# Altium schematic sheet Project_Overview.SchDoc
size A4; BoardName: ECG Pocket Monitor; SheetNumber: 1; SheetTotal: 8
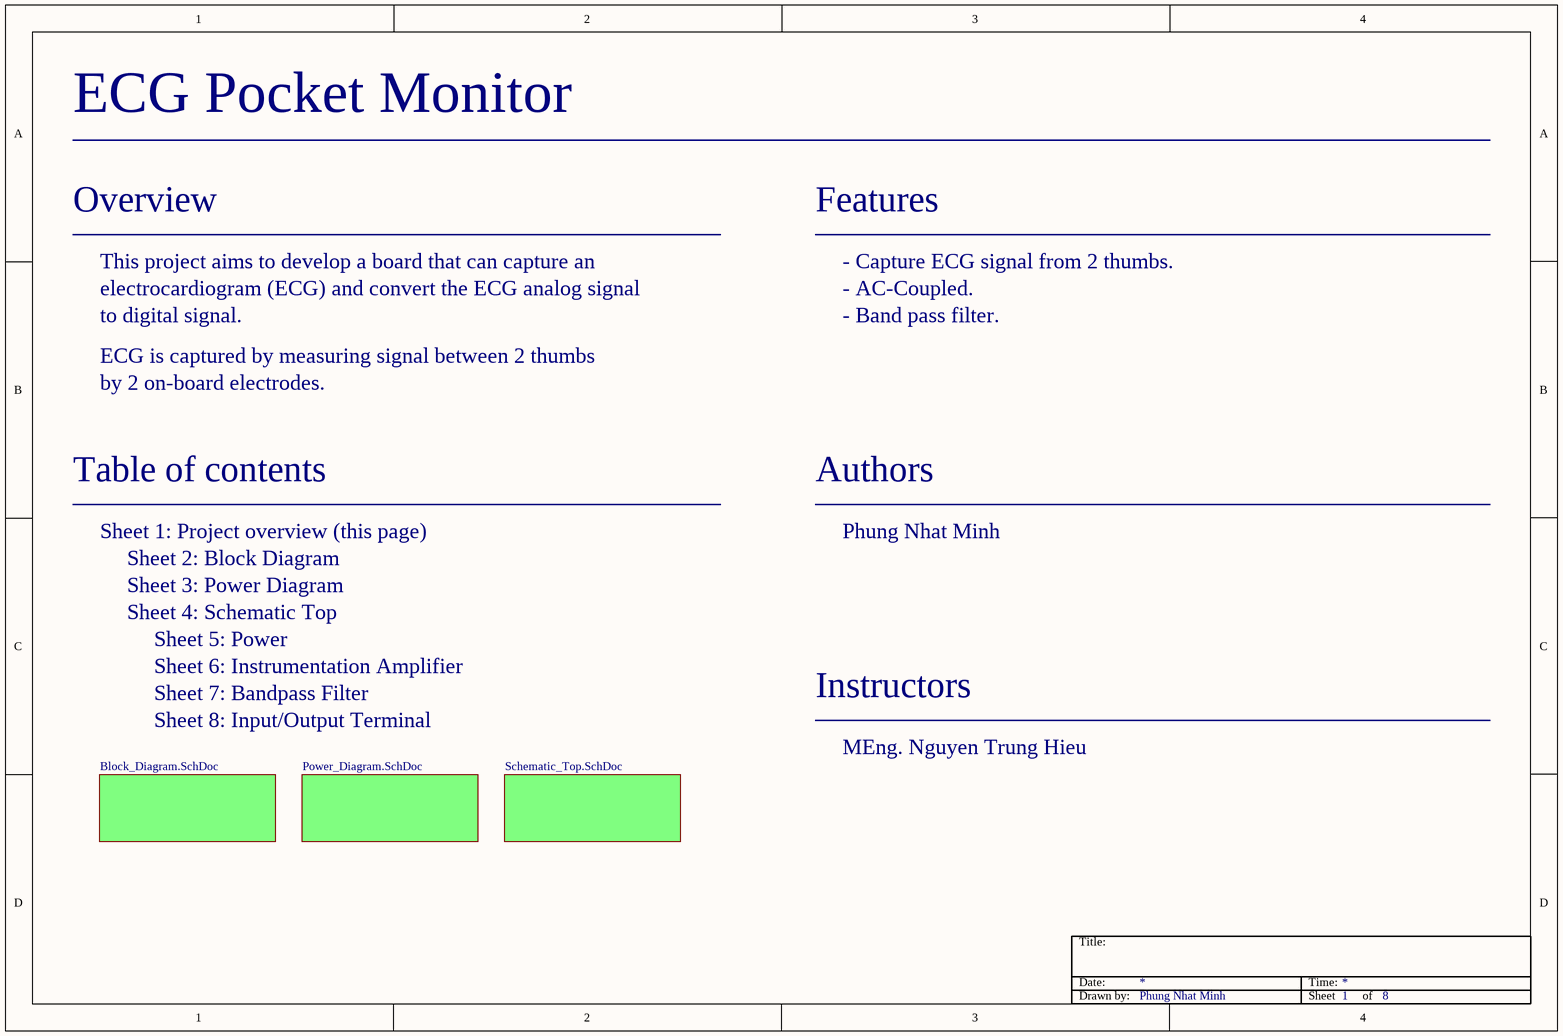
[diagram p0: Project_Overview.SchDoc]

## Sub-sheets
Designator = Block_Diagram.SchDoc: no entries
Designator = Power_Diagram.SchDoc: no entries
Designator = Schematic_Top.SchDoc: no entries

## Notes on the sheet
- Overview
- Features
- This project aims to develop a board that can capture an
- electrocardiogram (ECG) and convert the ECG analog signal
- - AC-Coupled.
- - Capture ECG signal from 2 thumbs.
- to digital signal.
- ECG is captured by measuring signal between 2 thumbs
- - Band pass filter.
- by 2 on-board electrodes.
- Table of contents
- Authors
- Sheet 1: Project overview (this page)
- Sheet 2: Block Diagram
- Phung Nhat Minh
- Sheet 4: Schematic Top
- Sheet 3: Power Diagram
- Sheet 5: Power
- Sheet 7: Bandpass Filter
- Sheet 6: Instrumentation Amplifier
- Instructors
- Sheet 8: Input/Output Terminal
- MEng. Nguyen Trung Hieu
- Title:
- Date:
- Time:
- Drawn by:
- Sheet
- of